# EAGLE design lm358-thermostat (EAGLE 5.07)
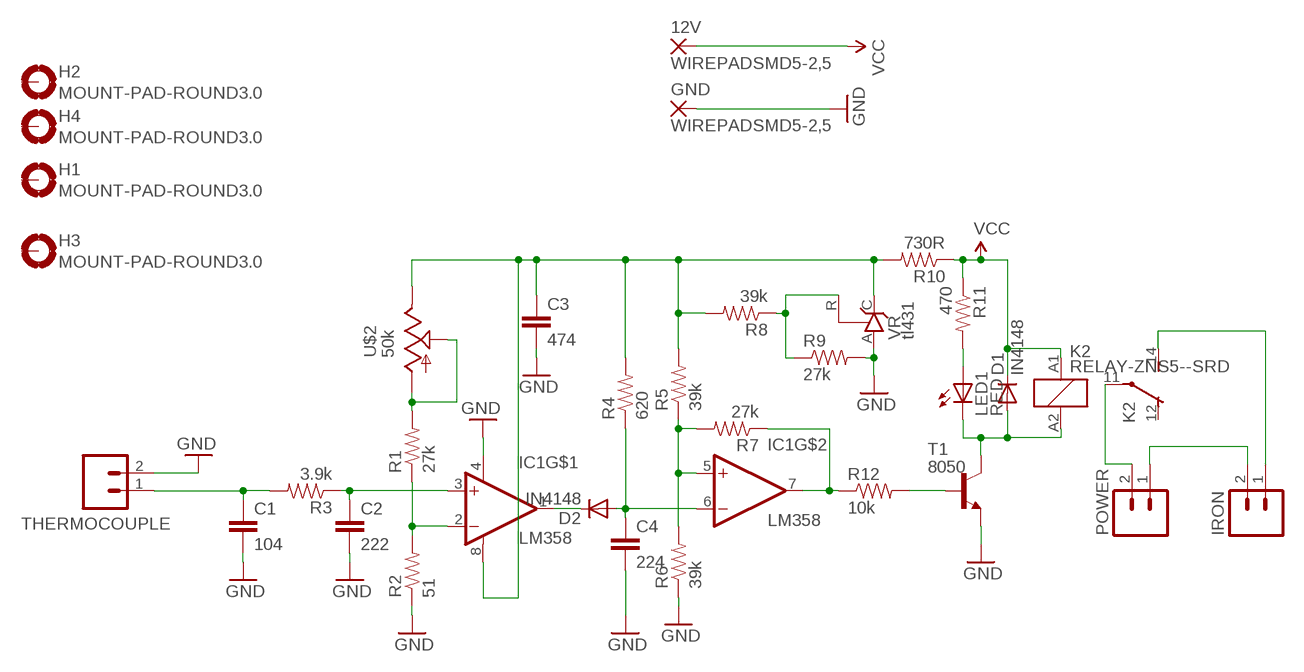
[diagram p0: schematic, sheet 1]

## Parts
12V  WIREPADSMD5-2,5  [5-2,5]
C1  104  CAPPTH  [CAP-PTH-SMALL]
C2  222  CAP0805  [0805]
C3  474  CAP0805  [0805]
C4  224  CAP0805  [0805]
D1  IN4148  DIODE1N4148  [DIODE-1N4148]
D2  IN4148  DIODE1N4148  [DIODE-1N4148]
GND  WIREPADSMD5-2,5  [5-2,5]
H1  MOUNT-PAD-ROUND3.0  [3,0-PAD]
H2  MOUNT-PAD-ROUND3.0  [3,0-PAD]
H3  MOUNT-PAD-ROUND3.0  [3,0-PAD]
H4  MOUNT-PAD-ROUND3.0  [3,0-PAD]
IC1  LM358  [DIP08]
IRON  M025MM  [SCREWTERMINAL-5MM-2]
K2  RELAY-ZNS5--SRD  [SRD-05]
LED1  RED  LED5MM  [LED5MM]
POWER  M025MM  [SCREWTERMINAL-5MM-2]
R1  27k  RESISTOR1/4W  [AXIAL-0.3]
R2  51  RESISTOR1/4W  [AXIAL-0.3]
R3  3.9k  RESISTOR1/4W  [AXIAL-0.3]
R4  620  RESISTOR1/4W  [AXIAL-0.3]
R5  39k  RESISTOR1/4W  [AXIAL-0.3]
R6  39k  RESISTOR1/4W  [AXIAL-0.3]
R7  27k  RESISTOR1/4W  [AXIAL-0.3]
R8  39k  RESISTOR1/4W  [AXIAL-0.3]
R9  27k  RESISTOR1/4W  [AXIAL-0.3]
R10  730R  RESISTOR1/4W  [AXIAL-0.3]
R11  470  RESISTOR1/4W  [AXIAL-0.3]
R12  10k  RESISTOR1/4W  [AXIAL-0.3]
T1  8050  90**-NPN-TO92-EBC  [TO92-EBC]
THERMOCOUPLE  M025MM  [SCREWTERMINAL-5MM-2]
U$2  50k  POTB64Y-3296  [B64Y]
VR  tl431  TL431RAC  [TO92-RAC]

## Nets
GND: C1.2 C2.2 C3.2 C4.2 GND.1(P) IC1.4(V-) R2.P$1 R6.P$1 R9.P$2 T1.E THERMOCOUPLE.2 VR.A
N$1: C2.1 IC1.3(+IN) R3.P$1
N$2: IC1.2(-IN) R1.P$1 R2.P$2
N$3: R1.P$2 U$2.A U$2.S
N$4: IC1.7(OUT) R7.P$1 R12.P$1
N$5: C1.1 R3.P$2 THERMOCOUPLE.1
N$6: D2.C IC1.1(OUT)
N$7: C4.1 D2.A IC1.6(-IN) R4.P$1
N$8: R12.P$2 T1.B
N$9: D1.A K2.A2 LED1.K(C) T1.C
N$10: C3.1 IC1.8(V+) R4.P$2 R5.P$2 R8.P$2 R10.P$2 U$2.E VR.C
N$11: IC1.5(+IN) R5.P$1 R6.P$2 R7.P$2
N$12: R8.P$1 R9.P$1 VR.R
N$14: IRON.2 POWER.1
N$15: K2.11(2:P) POWER.2
N$16: IRON.1 K2.14(2:S)
N$17: LED1.A R11.P$2
VCC: 12V.1(P) D1.C K2.A1 R10.P$1 R11.P$1
Unconnected: H1.B3,0(MOUNT) H2.B3,0(MOUNT) H3.B3,0(MOUNT) H4.B3,0(MOUNT) K2.12(2:O)

## Library data of the parts
12V GND = wirepad:WIREPAD: Wire PAD connect wire on PCB
C1-C4 = digital-toy:CAP: Capacitor Standard 0603 ceramic capacitor, and 0.1" leaded capacitor.
D1 D2 = digital-toy:DIODE: Diode These are standard reverse protection diodes and small signal diodes. SMA package can handle up to about 1A. SOD-323 can handle about 200mA. What the SOD-323 package when ordering, there are some mfgs out there that are 5-pin packages.
H1-H4 = holes:MOUNT-PAD-ROUND: MOUNTING PAD, round
IC1 = digital-toy:LM358
IRON POWER THERMOCOUPLE = SparkFun:M02: Header 2 Standard 2-pin 0.1" header. Use with straight break away headers (SKU : PRT-00116), right angle break away headers (PRT-00553), swiss pins (PRT-00743), machine pins (PRT-00117), and female headers (PRT-00115). Molex polarized connector foot print use with SKU : PRT-08233 with associated crimp pins and housings.
K2 = digital-toy:RELAY-ZNS5-*: Miniature Power PCB Relay SCHRACK 1pole 10 A Source: http://www.schrack.com/.. 5847.pdf
LED1 = SparkFun:LED: LEDs Standard schematic elements and footprints for 5mm, 3mm, 1206, and 0603 sized LEDs. 5mm - Spark Fun Electronics SKU : COM-00529 (and others)
R1-R12 = digital-toy:RESISTOR: Resistor Basic schematic elements and footprints for 0603, 1206, and PTH 1/10th watt (small) resistors. digital-toy copy vertical mount of axial-0.3 from rcl.lbr : the 0207/xx
T1 = digital-toy:*-NPN-: NPN Transistror most of sot-23 use the pacages sot23-BEC, top C, left B, right E. by hyl, digital-toy. and to-92 use ebc(from-top) by hyl, digital-toy.
U$2 = digital-toy:POT: POT digital toy POT, 3296 multi turn, blue-white ... hyl 8/07/2001
VR = digital-toy:TL431: VOLTAGE REGULATOR

## Board
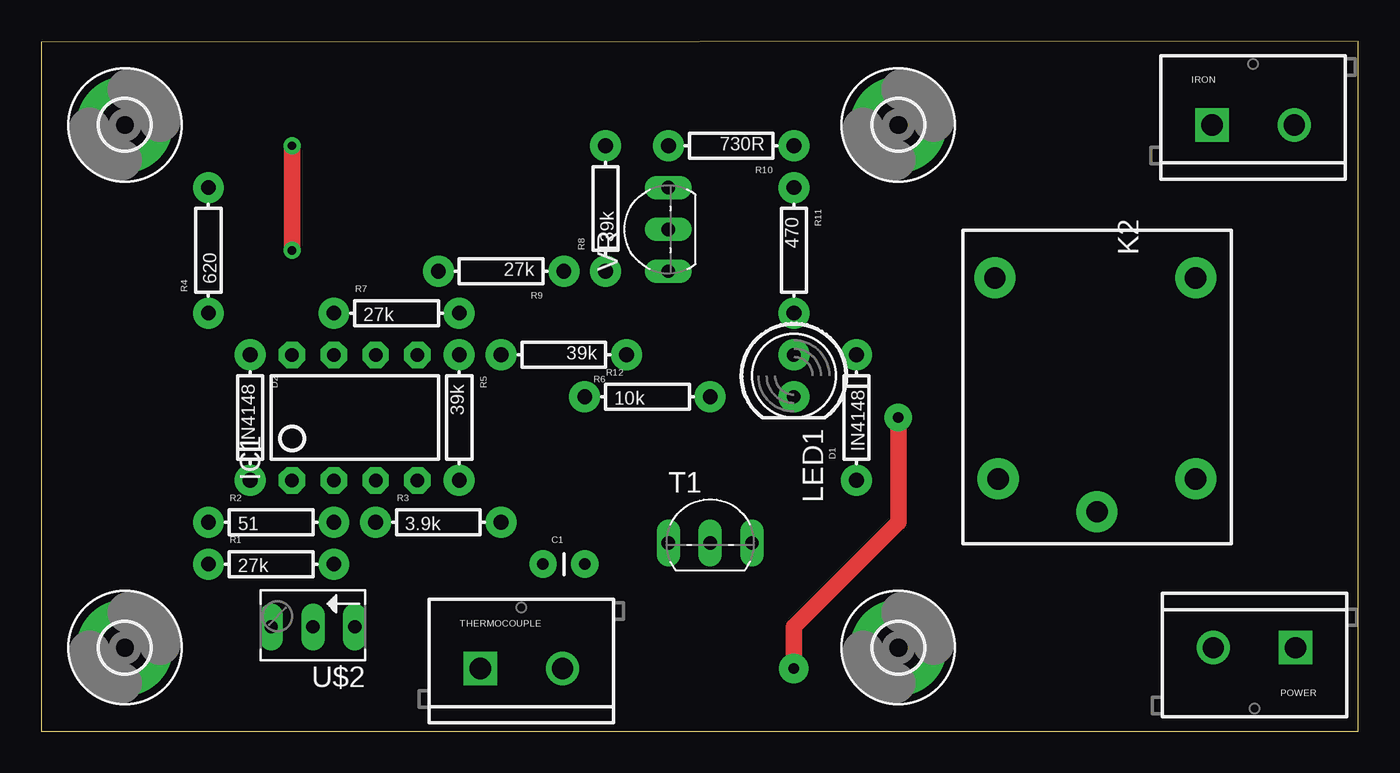
[diagram p1: board, top side]
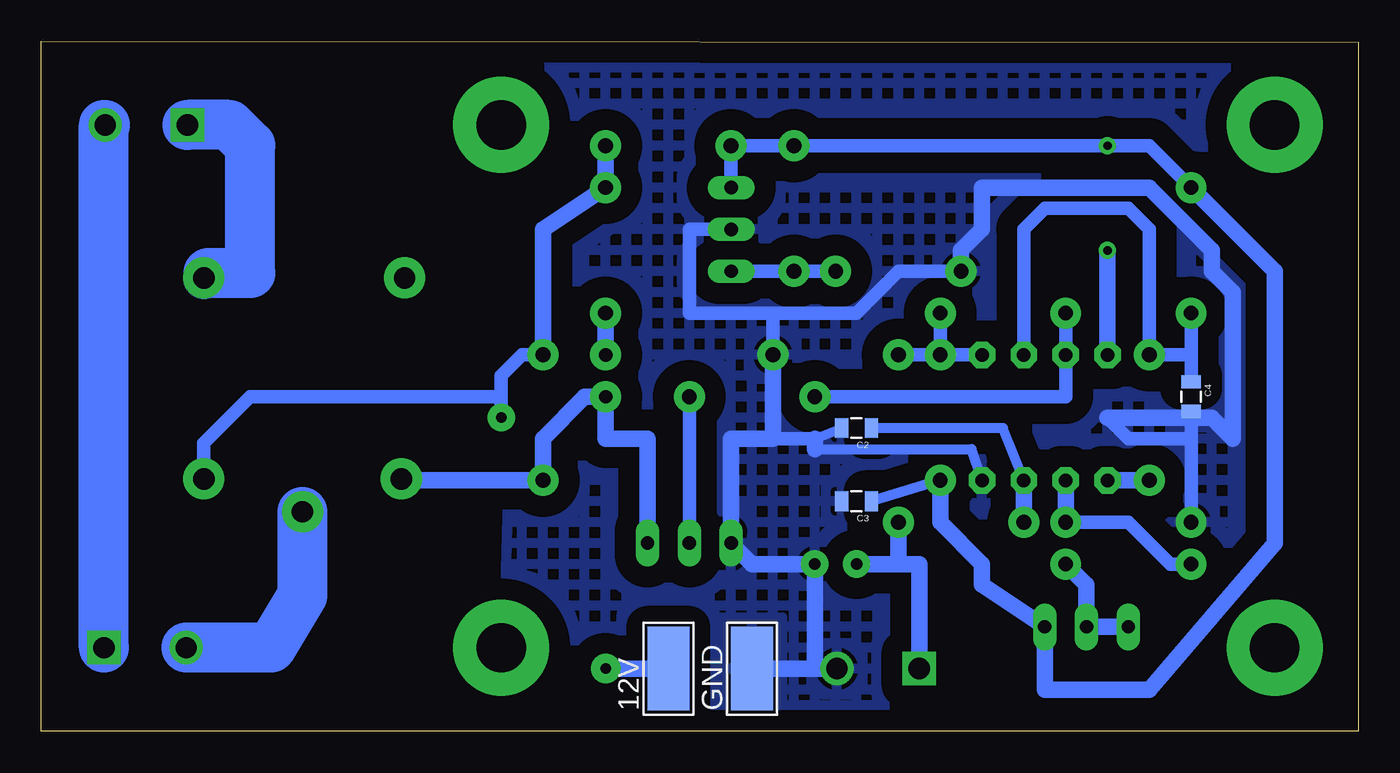
[diagram p2: board, bottom side, seen from below]

Size 80.01 x 41.91 mm. Coordinates in mm from the lower left corner, seen from the top.
Outline: 0,0 80.01,0 80.01,41.91 0,41.83 0,0
Copper layers (1*16): Top 0.035mm / dielectric 1.5mm / Bottom 0.035mm
Design rules "SparkFun-HP1007-600x600dpi": minimum track width 10mil, minimum drill 20mil, track to track 12mil, track to pad 12mil, pad to pad 12mil, via to via 12mil, smd to smd 12mil, copper to edge 12mil, drill to drill 12mil, minimum pad ring 12mil, minimum via ring 10mil, stop-mask expansion 4mil, vias tented up to drill 25mil, thermal gap 10mil

### Footprints (pad centres in the part's own frame; a part is rotated, then mirrored left to right if it is on the bottom)
5-2,5 = smd 2.54 x 5.08: 1 0,0
CAP-PTH-SMALL = drill 0.7 pad 1.651 round: 1 0,0; 2 2.54,0
0805 = smd 0.8 x 1.2: 1 -0.9,0; 2 0.9,0
DIODE-1N4148 = drill 0.9 pad 1.88 round: A -3.81,0; C 3.81,0
3,0-PAD = drill 3 pad 5.842 round: B3,0 0,0
DIP08 = drill 0.813 pad 1.6 octagon: 1 -3.81,-3.81; 2 -1.27,-3.81; 3 1.27,-3.81; 4 3.81,-3.81; 5 3.81,3.81; 6 1.27,3.81; 7 -1.27,3.81; 8 -3.81,3.81
SCREWTERMINAL-5MM-2 = drill 1.3 pad 2.032 square: 1 0,0 | drill 1.3 pad 2.032 round: 2 5,0
SRD-05 = drill 1.3 pad 2.5 round: 11 17.145,8.255; 12 2.945,2.055; 14 2.945,14.255; A1 15.145,14.255; A2 15.145,2.255
LED5MM = drill 0.813 pad 1.88 round: A -1.27,0; K 1.27,0
AXIAL-0.3 = drill 0.9 pad 1.88 round: P$1 -3.81,0; P$2 3.81,0
TO92-EBC = drill 0.813 long: B 0,-1.27; C 2.54,-1.27; E -2.54,-1.27
B64Y = drill 0.813 long: A 2.54,0; E -2.54,0; S 0,0
TO92-RAC = drill 0.813 long: A 0,0; C 2.54,0; R -2.54,0

### Placement (x,y rotation side)
12V  41.91,3.81 0 bottom
C1  30.48,10.16 0 top
C2  30.48,18.41 180 bottom
C3  30.48,13.97 180 bottom
C4  10.16,20.32 270 bottom
D1  49.53,19.05 90 top
D2  12.7,19.05 270 top
GND  36.83,3.81 0 bottom
H1  52.07,36.83 0 top
H2  52.07,5.08 0 top
H3  5.08,5.08 0 top
H4  5.08,36.83 0 top
IC1  19.05,19.05 0 top
IRON  71.12,36.83 0 top
K2  55.88,30.48 270 top
LED1  45.72,21.59 270 top
POWER  76.2,5.08 180 top
R1  13.97,10.16 0 top
R2  13.97,12.7 0 top
R3  24.13,12.7 0 top
R4  10.16,29.21 90 top
R5  25.4,19.05 270 top
R6  31.75,22.86 180 top
R7  21.59,25.4 0 top
R8  34.29,31.75 90 top
R9  27.94,27.94 180 top
R10  41.91,35.56 180 top
R11  45.72,29.21 270 top
R12  36.83,20.32 0 top
T1  40.64,12.7 0 top
THERMOCOUPLE  26.67,3.81 0 top
U$2  16.51,6.35 180 top
VR  38.1,30.48 90 top

### Tracks (layer width: path | path; a pad name or v marks a point on that pad's centre or on a via)
GND
  Bottom 0.61: 33.02,17.78 C2.2 | IC1.4 23.5,17.14 33.02,17.14
  Bottom 0.813: R2.P$1 10.16,17.78 | 10.16,17.78 C4.2 | 35.56,17.78 33.02,17.78 | 35.56,25.4 R6.P$1 | VR.A 40.64,30.48 40.64,25.4 35.56,25.4 | 35.56,25.4 30.48,25.4 27.94,27.94 R9.P$2 | 15.24,19.05 13.97,17.78 10.16,17.78
  Bottom 1.016: 33.02,3.81 GND.1 | 33.02,3.81 C1.2 36.83,10.16 T1.E 38.1,17.78 35.56,17.78 R6.P$1 | 33.02,3.81 THERMOCOUPLE.2 | 15.24,19.05 8.89,19.05 7.62,17.78 7.62,26.67 8.89,27.94 8.89,29.21 12.7,33.02 22.86,33.02 22.86,30.48 24.13,29.21 R9.P$2 | 33.02,17.78 33.02,17.14
  pour Bottom (isolate 1.27, hatched): -5.08,46.99 50.8,45.72 52.07,0 -7.62,0
N$1
  Bottom 0.61: IC1.3 21.59,18.41 C2.1
  Bottom 1.016: R3.P$1 IC1.3
N$2
  Bottom 0.813: R1.P$1 11.43,10.16 13.97,12.7 R2.P$2
  Bottom 1.016: R2.P$2 IC1.2
N$3
  Bottom 1.016: U$2.A U$2.S 16.51,8.89 R1.P$2
N$4
  Bottom 0.813: R7.P$1 IC1.7 17.78,20.32 R12.P$1
N$5
  Bottom 1.016: 27.94,10.16 C1.1 | 27.94,10.16 R3.P$2 | THERMOCOUPLE.1 26.67,10.16 27.94,10.16
N$6
  Bottom 1.016: D2.C IC1.1
N$7
  Bottom 0.813: IC1.6 20.32,30.48 19.05,31.75 13.97,31.75 12.7,30.48 D2.A 10.16,22.86 | C4.1 10.16,22.86 | 10.16,22.86 R4.P$1
N$8
  Bottom 0.813: T1.B R12.P$2
N$9
  Bottom 1.016: T1.C 43.18,17.78 45.72,17.78 LED1.K 46.99,20.32 49.53,17.78 D1.A 58.04,15.24 K2.A2
N$10  (via drill 0.51)
  Top 1.016: v15.24,35.56 v15.24,29.21
  Bottom 0.61: R5.P$2 C3.1
  Bottom 0.813: VR.C R10.P$2 R8.P$2 v15.24,35.56 12.7,35.56 R4.P$2
  Bottom 1.016: R4.P$2 5.08,27.94 5.08,11.43 12.7,2.54 19.05,2.54 U$2.E 22.86,8.89 22.86,10.16 25.4,12.7 R5.P$2 | v15.24,29.21 IC1.8
N$11
  Bottom 0.813: IC1.5 R5.P$1 | R5.P$1 R7.P$2 | R5.P$1 R6.P$2
N$12
  Bottom 0.813: VR.R R8.P$1 R9.P$1
N$14
  Bottom 3.048: POWER.1 76.2,36.83 IRON.2
N$15
  Bottom 3.048: K2.11 64.14,8.26 66.04,5.08 POWER.2
N$16
  Bottom 2.54: 69.85,27.82 K2.14
  Bottom 3.048: IRON.1 68.58,36.83 67.31,35.56 67.31,27.82 69.85,27.82
N$17
  Bottom 1.016: LED1.A R11.P$2
VCC  (via drill 0.64 pad 1.68, 0.64 pad 1.78)
  Top 1.016: v45.72,3.81 45.72,6.35 52.07,12.7 v52.07,19.05
  Bottom 0.813: K2.A1 70.14,17.5 67.31,20.32 52.07,20.32 | v52.07,19.05 52.07,20.32 | D1.C 50.8,22.86 52.07,21.59 52.07,20.32
  Bottom 1.016: 12V.1 v45.72,3.81 | R10.P$1 R11.P$1 49.53,30.48 D1.C